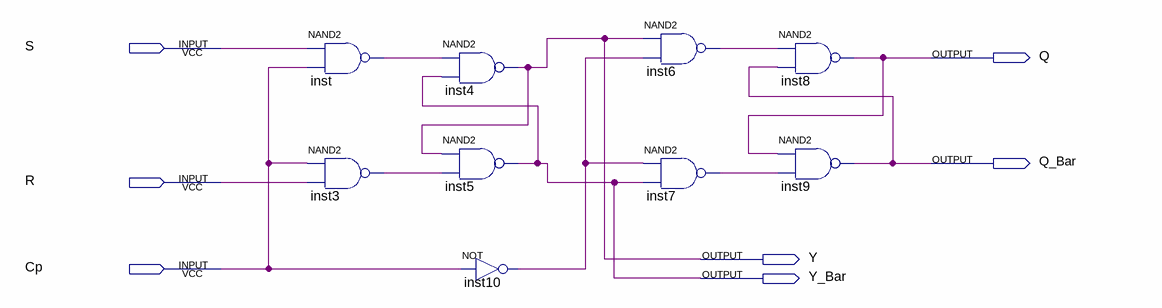
[diagram p0: schematic sheet]
// Quartus schematic MasterSlave_SR_FF.bdf as structural Verilog: 9 symbols, 7 pins
module MasterSlave_SR_FF (
  input  S,
  input  R,
  input  Cp,
  output Q,
  output Q_Bar,
  output Y,
  output Y_Bar
);

  wire inst3_out, inst6_out, inst7_out, inst10_out, inst_out;

  nand inst (inst_out, S, Cp);
  nand inst3 (inst3_out, Cp, R);
  nand inst4 (Y, inst_out, Y_Bar);
  nand inst5 (Y_Bar, Y, inst3_out);
  not inst10 (inst10_out, Cp);
  nand inst6 (inst6_out, Y, inst10_out);
  nand inst7 (inst7_out, inst10_out, Y_Bar);
  nand inst8 (Q, inst6_out, Q_Bar);
  nand inst9 (Q_Bar, Q, inst7_out);
endmodule
